# EAGLE design mainboard (EAGLE 7.4.0)
NESIZER synthesizer board
CREVISION: 2
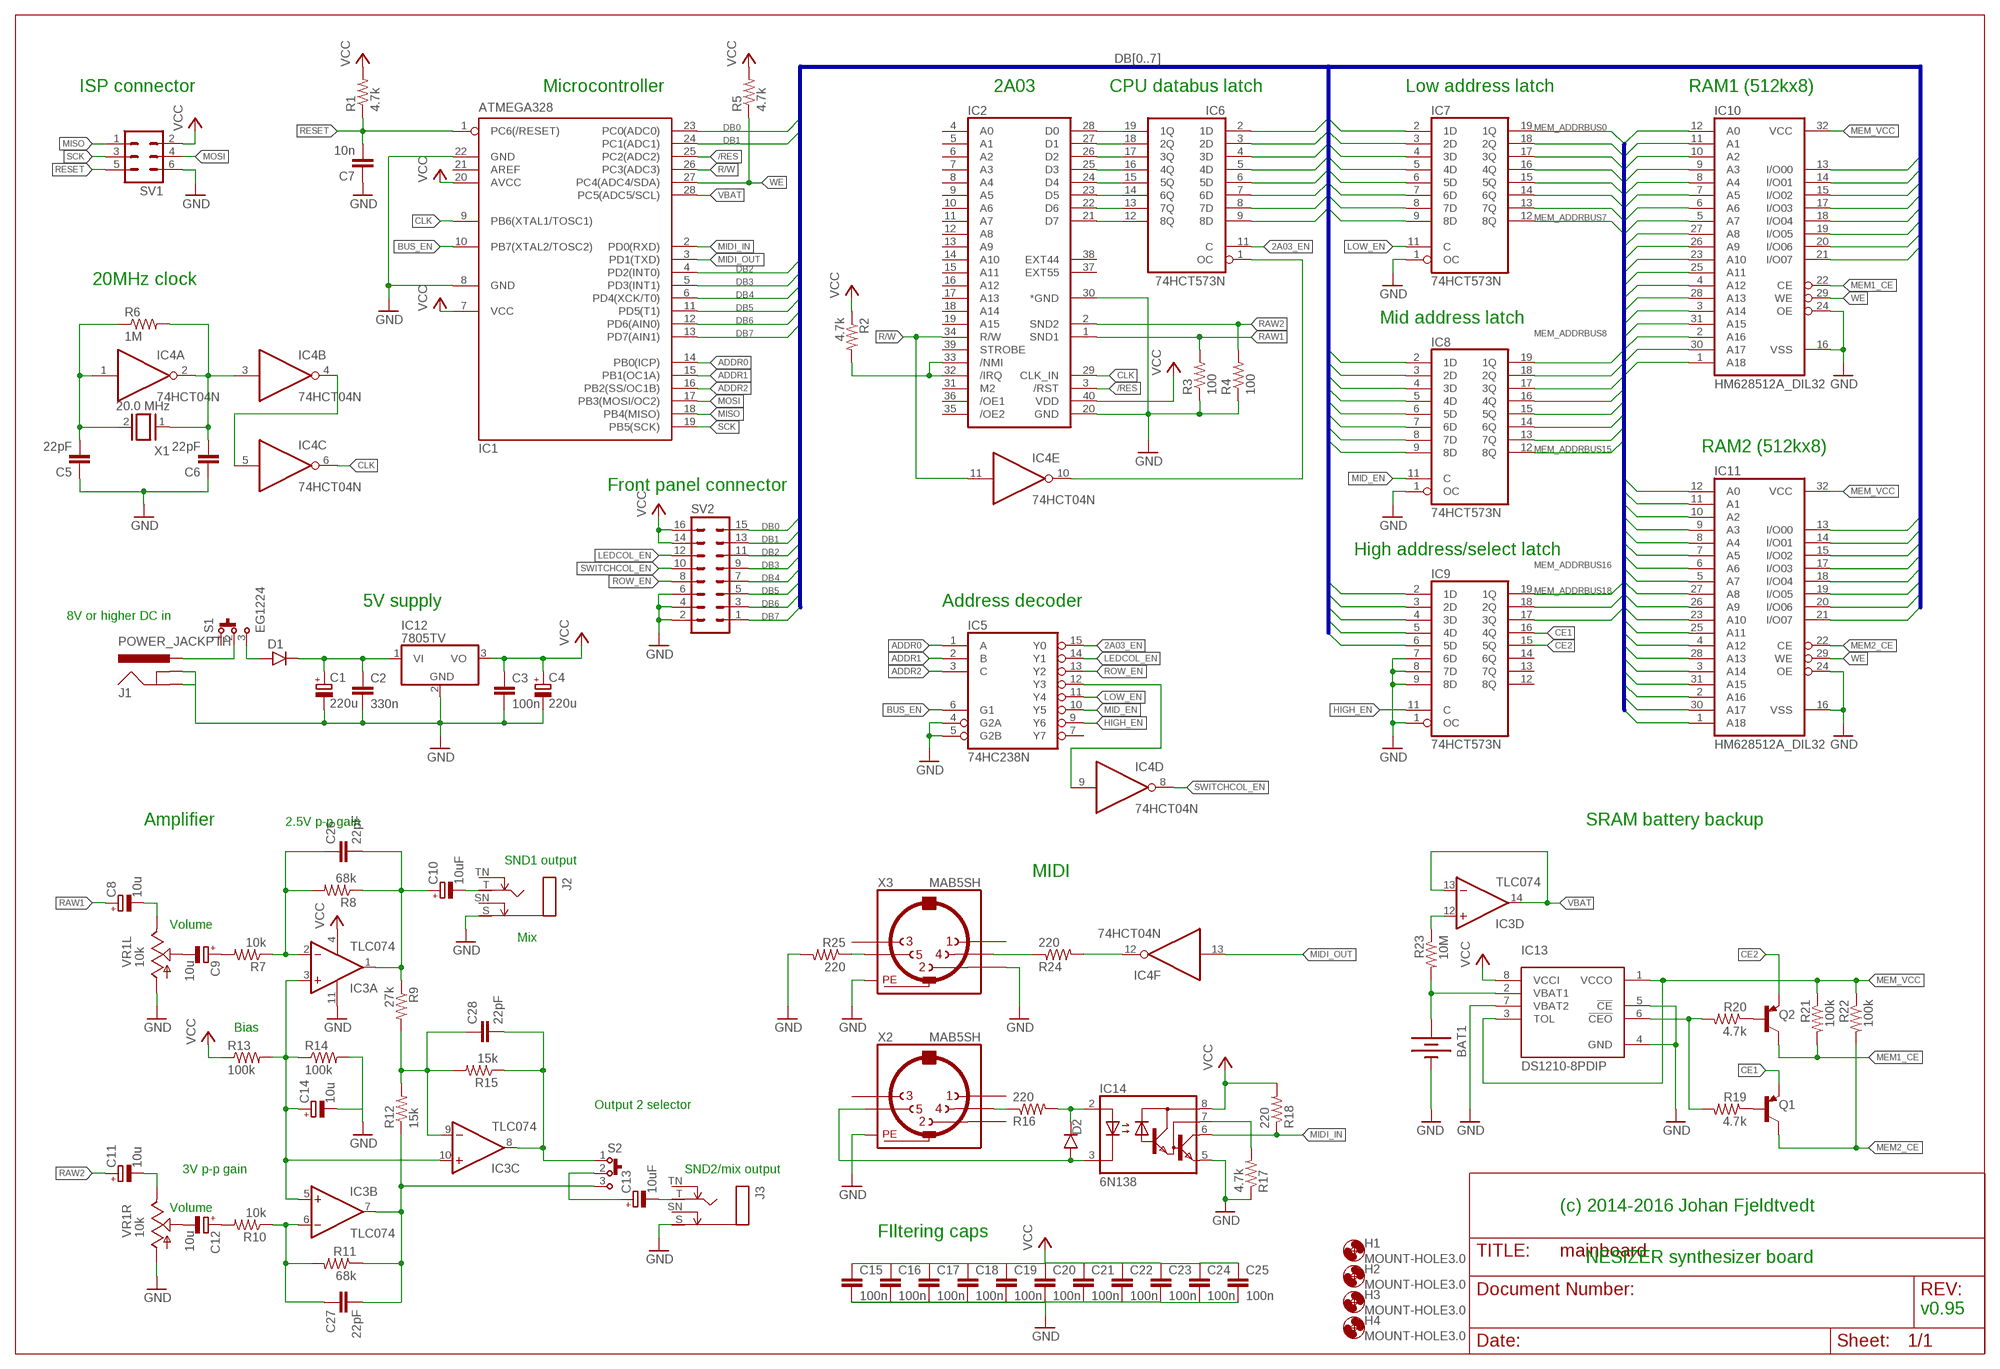
[diagram p0: schematic, sheet 1]

## Parts
BAT1  BATTERY20PTH  [BATTCOM_20MM_PTH]
C1  220u  CPOL-EUE5-10.5  [E5-10,5]
C2  330n  C-EU025-025X050  [C025-025X050]
C3  100n  C-EU025-025X050  [C025-025X050]
C4  220u  CPOL-EUE5-10.5  [E5-10,5]
C5  22pF  C2.5/2  [C2.5-2]
C6  22pF  C2.5/2  [C2.5-2]
C7  10n  C2.5/2  [C2.5-2]
C8  10u  CPOL-EUE2-5  [E2-5]
C9  10u  CPOL-EUE2-5  [E2-5]
C10  10uF  CPOL-EUE2-5  [E2-5]
C11  10u  CPOL-EUE2-5  [E2-5]
C12  10u  CPOL-EUE2-5  [E2-5]
C13  10uF  CPOL-EUE2-5  [E2-5]
C14  10u  CPOL-EUE2-5  [E2-5]
C15  100n  C-EU025-025X050  [C025-025X050]
C16  100n  C-EU025-025X050  [C025-025X050]
C17  100n  C-EU025-025X050  [C025-025X050]
C18  100n  C-EU025-025X050  [C025-025X050]
C19  100n  C-EU025-025X050  [C025-025X050]
C20  100n  C-EU025-025X050  [C025-025X050]
C21  100n  C-EU025-025X050  [C025-025X050]
C22  100n  C-EU025-025X050  [C025-025X050]
C23  100n  C-EU025-025X050  [C025-025X050]
C24  100n  C-EU025-025X050  [C025-025X050]
C25  100n  C-EU025-025X050  [C025-025X050]
C26  22pF  C2.5/2  [C2.5-2]
C27  22pF  C2.5/2  [C2.5-2]
C28  22pF  C2.5/2  [C2.5-2]
D1  1N400X.3  [DO41-3]
D2  1N914.3  [DO35-3]
H1  MOUNT-HOLE3.0  [3,0]
H2  MOUNT-HOLE3.0  [3,0]
H3  MOUNT-HOLE3.0  [3,0]
H4  MOUNT-HOLE3.0  [3,0]
IC1  ATMEGA328  MEGA8-P  [DIL28-3]
IC2  2A03  [DIL40]
IC3  TLC074  TL074P  [DIL14]
IC4  74HCT04N  [DIL14]
IC5  74HC238N  74HC138N  [DIL16]
IC6  74HCT573N  [DIL20]
IC7  74HCT573N  [DIL20]
IC8  74HCT573N  [DIL20]
IC9  74HCT573N  [DIL20]
IC10  HM628512A_DIL32  [DIL32]
IC11  HM628512A_DIL32  [DIL32]
IC12  7805TV  [TO220V]
IC13  DS1210-8PDIP  [DIL08]
IC14  6N138  [DIL08]
J1  POWER_JACKPTH  [POWER_JACK_PTH]
J2  MONOSW  [NMJ4HCD2]
J3  MONOSW  [NMJ4HCD2]
Q1  BC557  [TO92]
Q2  BC557  [TO92]
R1  4.7k  R-US_0207/7  [0207/7]
R2  4.7k  R-US_0207/7  [0207/7]
R3  100  R-US_0207/7  [0207/7]
R4  100  R-US_0207/7  [0207/7]
R5  4.7k  R-US_0207/7  [0207/7]
R6  1M  R-US_0207/7  [0207/7]
R7  10k  R-US_0207/7  [0207/7]
R8  68k  R-US_0207/7  [0207/7]
R9  27k  R-US_0207/7  [0207/7]
R10  10k  R-US_0207/7  [0207/7]
R11  68k  R-US_0207/7  [0207/7]
R12  15k  R-US_0207/7  [0207/7]
R13  100k  R-US_0207/7  [0207/7]
R14  100k  R-US_0207/7  [0207/7]
R15  15k  R-US_0207/7  [0207/7]
R16  220  R-US_0207/7  [0207/7]
R17  4.7k  R-US_0207/7  [0207/7]
R18  220  R-US_0207/7  [0207/7]
R19  4.7k  R-US_0207/7  [0207/7]
R20  4.7k  R-US_0207/7  [0207/7]
R21  100k  R-US_0207/7  [0207/7]
R22  100k  R-US_0207/7  [0207/7]
R23  10M  R-US_0207/7  [0207/7]
R24  220  R-US_0207/7  [0207/7]
R25  220  R-US_0207/7  [0207/7]
S1  EG1224  [EG1224]
S2  EG1224  [EG1224]
SV1  MA03-2  [MA03-2]
SV2  MA08-2  [MA08-2]
VR1  10k  ALPS_RK0971221Z0N  [ALPS_RK0971221Z0X]
X1  20.0 MHz  XTAL/S  [QS]
X2  MAB5SH  [MAB5SH]
X3  MAB5SH  [MAB5SH]

## Nets
2A03_EN: IC5.15(Y0) IC6.11(C)
/RES: IC1.25(PC2(ADC2)) IC2.3(/RST)
ADDR0: IC1.14(PB0(ICP)) IC5.1(A)
ADDR1: IC1.15(PB1(OC1A)) IC5.2(B)
ADDR2: IC1.16(PB2(SS/OC1B)) IC5.3(C)
BUS_EN: IC1.10(PB7(XTAL2/TOSC2)) IC5.6(G1)
C6: C8.- VR1.I1
CE1: IC9.16(4Q) Q1.1(E)
CE2: IC9.15(5Q) Q2.1(E)
CLK: IC1.9(PB6(XTAL1/TOSC1)) IC2.29(CLK_IN) IC4.6(C:O)
DB0: IC1.23(PC0(ADC0)) IC6.2(1D) IC7.2(1D) IC8.2(1D) IC9.2(1D) IC10.13(I/O00) IC11.13(I/O00) SV2.15
DB1: IC1.24(PC1(ADC1)) IC6.3(2D) IC7.3(2D) IC8.3(2D) IC9.3(2D) IC10.14(I/O01) IC11.14(I/O01) SV2.13
DB2: IC1.4(PD2(INT0)) IC6.4(3D) IC7.4(3D) IC8.4(3D) IC9.4(3D) IC10.15(I/O02) IC11.15(I/O02) SV2.11
DB3: IC1.5(PD3(INT1)) IC6.5(4D) IC7.5(4D) IC8.5(4D) IC9.5(4D) IC10.17(I/O03) IC11.17(I/O03) SV2.9
DB4: IC1.6(PD4(XCK/T0)) IC6.6(5D) IC7.6(5D) IC8.6(5D) IC9.6(5D) IC10.18(I/O04) IC11.18(I/O04) SV2.7
DB5: IC1.11(PD5(T1)) IC6.7(6D) IC7.7(6D) IC8.7(6D) IC10.19(I/O05) IC11.19(I/O05) SV2.5
DB6: IC1.12(PD6(AIN0)) IC6.8(7D) IC7.8(7D) IC8.8(7D) IC10.20(I/O06) IC11.20(I/O06) SV2.3
DB7: IC1.13(PD7(AIN1)) IC6.9(8D) IC7.9(8D) IC8.9(8D) IC10.21(I/O07) IC11.21(I/O07) SV2.1
GND: BAT1.2(-) C1.- C2.2 C3.2 C4.- C5.1 C6.1 C7.1 C14.- C15.2 C16.2 C17.2 C18.2 C19.2 C20.2 C21.2 C22.2 C23.2 C24.2 C25.2 IC1.8(GND) IC1.22(GND) IC2.20(GND) IC2.30(*GND) IC3.11(P:V-) IC5.4(G2A) IC5.5(G2B) IC7.1(OC) IC8.1(OC) IC9.1(OC) IC9.7(6D) IC9.8(7D) IC9.9(8D) IC10.16(VSS) IC10.24(OE) IC11.16(VSS) IC11.24(OE) IC12.2(GND) IC13.4(GND) IC13.5(!CE) IC13.7(VBAT2) IC14.5(GND) J1.GND J1.GNDBREAK J2.S J3.S R3.1 R4.1 R14.2 R17.1 R25.2 SV1.6 SV2.2 SV2.4 SV2.6 VR1.G1 VR1.G2 X2.PE X2.PE@(PE) X3.2 X3.PE X3.PE@(PE)
HIGH_EN: IC5.9(Y6) IC9.11(C)
LEDCOL_EN: IC5.14(Y1) SV2.12
LOW_EN: IC5.11(Y4) IC7.11(C)
MEM1_CE: IC10.22(CE) Q2.3(C) R21.2
MEM2_CE: IC11.22(CE) Q1.3(C) R22.2
MEM_ADDRBUS0: IC7.19(1Q) IC10.12(A0) IC11.12(A0)
MEM_ADDRBUS1: IC7.18(2Q) IC10.11(A1) IC11.11(A1)
MEM_ADDRBUS2: IC7.17(3Q) IC10.10(A2) IC11.10(A2)
MEM_ADDRBUS3: IC7.16(4Q) IC10.9(A3) IC11.9(A3)
MEM_ADDRBUS4: IC7.15(5Q) IC10.8(A4) IC11.8(A4)
MEM_ADDRBUS5: IC7.14(6Q) IC10.7(A5) IC11.7(A5)
MEM_ADDRBUS6: IC7.13(7Q) IC10.6(A6) IC11.6(A6)
MEM_ADDRBUS7: IC7.12(8Q) IC10.5(A7) IC11.5(A7)
MEM_ADDRBUS8: IC8.19(1Q) IC10.27(A8) IC11.27(A8)
MEM_ADDRBUS9: IC8.18(2Q) IC10.26(A9) IC11.26(A9)
MEM_ADDRBUS10: IC8.17(3Q) IC10.23(A10) IC11.23(A10)
MEM_ADDRBUS11: IC8.16(4Q) IC10.25(A11) IC11.25(A11)
MEM_ADDRBUS12: IC8.15(5Q) IC10.4(A12) IC11.4(A12)
MEM_ADDRBUS13: IC8.14(6Q) IC10.28(A13) IC11.28(A13)
MEM_ADDRBUS14: IC8.13(7Q) IC10.3(A14) IC11.3(A14)
MEM_ADDRBUS15: IC8.12(8Q) IC10.31(A15) IC11.31(A15)
MEM_ADDRBUS16: IC9.19(1Q) IC10.2(A16) IC11.2(A16)
MEM_ADDRBUS17: IC9.18(2Q) IC10.30(A17) IC11.30(A17)
MEM_ADDRBUS18: IC9.17(3Q) IC10.1(A18) IC11.1(A18)
MEM_VCC: IC10.32(VCC) IC11.32(VCC) IC13.1(VCCO) IC13.3(TOL) R21.1 R22.1
MID_EN: IC5.10(Y5) IC8.11(C)
MIDI_IN: IC1.2(PD0(RXD)) IC14.6(VO) R18.1
MIDI_OUT: IC1.3(PD1(TXD)) IC4.13(F:I)
MIDI_PIN_4: R16.1 X2.4
MIDI_PIN_5: D2.A IC14.3(C) X2.5
MISO: IC1.18(PB4(MISO)) SV1.1
MOSI: IC1.17(PB3(MOSI/OC2)) SV1.4
N$1: C5.2 IC4.1(A:I) R6.1 X1.2
N$2: C6.2 IC4.2(A:O) IC4.3(B:I) R6.2 X1.1
N$3: IC2.21(D7) IC6.12(8Q)
N$4: IC2.22(D6) IC6.13(7Q)
N$5: IC2.23(D5) IC6.14(6Q)
N$6: IC2.24(D4) IC6.15(5Q)
N$7: IC2.25(D3) IC6.16(4Q)
N$8: IC2.26(D2) IC6.17(3Q)
N$9: IC2.27(D1) IC6.18(2Q)
N$10: IC2.28(D0) IC6.19(1Q)
N$11: IC4.4(B:O) IC4.5(C:I)
N$12: IC4.9(D:I) IC5.12(Y3)
N$13: C13.+ S2.2
N$14: C28.1 IC3.9(C:-IN) R9.2 R12.2 R15.2
N$15: C9.+ R7.2
N$16: IC2.32(/IRQ) IC2.33(/NMI) R2.2
N$17: C11.- VR1.I2
N$18: C26.1 IC3.2(A:-IN) R7.1 R8.2
N$19: IC3.12(D:+IN) R23.1
N$20: IC14.7(VB) R17.2
N$21: C12.+ R10.2
N$22: C10.- J2.T
N$23: C13.- J3.T
N$24: C27.1 IC3.6(B:-IN) R10.1 R11.2
N$25: C10.+ C26.2 IC3.1(A:OUT) R8.1 R9.1
N$26: C28.2 IC3.8(C:OUT) R15.1 S2.1
N$27: D1.A S1.3
N$28: C14.+ IC3.3(A:+IN) IC3.5(B:+IN) IC3.10(C:+IN) R13.2 R14.1
N$29: IC4.10(E:O) IC6.1(OC)
N$30: C9.- VR1.O1
N$31: J1.PWR S1.2
N$32: C12.- VR1.O2
N$33: IC13.6(!CEO) R19.2 R20.2
N$34: D2.C IC14.2(A) R16.2
N$35: C1.+ C2.1 D1.C IC12.1(VI)
N$36: C27.2 IC3.7(B:OUT) R11.1 R12.1 S2.3
N$37: Q1.2(B) R19.1
N$38: Q2.2(B) R20.1
N$39: BAT1.1(+) IC13.2(VBAT1) R23.2
N$40: IC4.12(F:O) R24.2
N$41: R24.1 X3.4
N$42: R25.1 X3.5
R/W: IC1.26(PC3(ADC3)) IC2.34(R/W) IC4.11(E:I)
RAW1: C8.+ IC2.1(SND1) R3.2
RAW2: C11.+ IC2.2(SND2) R4.2
RESET: C7.2 IC1.1(PC6(/RESET)) R1.1 SV1.5
ROW_EN: IC5.13(Y2) SV2.8
SCK: IC1.19(PB5(SCK)) SV1.3
SWITCHCOL_EN: IC4.8(D:O) SV2.10
VBAT: IC1.28(PC5(ADC5/SCL)) IC3.13(D:-IN) IC3.14(D:OUT)
VCC: C3.1 C4.+ C15.1 C16.1 C17.1 C18.1 C19.1 C20.1 C21.1 C22.1 C23.1 C24.1 C25.1 IC1.7(VCC) IC1.20(AVCC) IC2.40(VDD) IC3.4(P:V+) IC12.3(VO) IC13.8(VCCI) IC14.8(VCC) R1.2 R2.1 R5.2 R13.1 R18.2 SV1.2 SV2.14 SV2.16
WE: IC1.27(PC4(ADC4/SDA)) IC10.29(WE) IC11.29(WE) R5.1
Unconnected: IC1.21(AREF) IC2.4(A0) IC2.5(A1) IC2.6(A2) IC2.7(A3) IC2.8(A4) IC2.9(A5) IC2.10(A6) IC2.11(A7) IC2.12(A8) IC2.13(A9) IC2.14(A10) IC2.15(A11) IC2.16(A12) IC2.17(A13) IC2.18(A14) IC2.19(A15) IC2.31(M2) IC2.35(/OE2) IC2.36(/OE1) IC2.37(EXT55) IC2.38(EXT44) IC2.39(STROBE) IC5.7(Y7) IC9.12(8Q) IC9.13(7Q) IC9.14(6Q) J2.SN J2.TN J3.SN J3.TN S1.1 X2.1 X2.2 X2.3 X3.1 X3.3

## Buses
DB[0..7]
MEM_ADDRBUS[0..18]

## Notes on the sheet
- ISP connector | Microcontroller | 2A03 | CPU databus latch | Low address latch | RAM1 (512kx8)
- 20MHz clock
- Mid address latch
- RAM2 (512kx8)
- Front panel connector
- High address/select latch
- 5V supply | Address decoder
- 8V or higher DC in
- Amplifier | 2.5V p-p gain | SRAM battery backup
- SND1 output
- MIDI
- Volume
- Mix
- Bias
- Output 2 selector
- 3V p-p gain | SND2/mix output
- Volume | (c) 2014-2016 Johan Fjeldtvedt
- FIltering caps
- NESIZER synthesizer board
- v0.95

## Power pins joined to a net without a drawn wire
GND: IC4.7(P:GND) IC5.8(GND) IC6.10(GND) IC7.10(GND) IC8.10(GND) IC9.10(GND)
S1: VR1.S1
S2: VR1.S2
VCC: IC4.14(P:VCC) IC5.16(VCC) IC6.20(VCC) IC7.20(VCC) IC8.20(VCC) IC9.20(VCC)

## Library data of the parts
BAT1 = SparkFun-Electromechanical:BATTERY: Battery Holders Various common sizes : AA, AAA, 20mm coin cell and 12mm coin cell. 20MM_4LEGS, BATT-10373
C1 C4 C8-C14 = resistor:CPOL-EU: POLARIZED CAPACITOR, European symbol
C2 = resistor:C-EU: CAPACITOR, European symbol
C3 C15-C25 = rcl:C-EU: CAPACITOR, European symbol
C5-C7 C26-C28 = capacitor-wima:C: CAPACITOR naming: grid - package width
D1 = gm-diodes:1N400X: Rectifier Diodes often used in power supply to prevent damage from reverse polarization
D2 = gm-diodes:1N914: Fast Switching Diode DO-35 glass case a.k.a. 1N4148
H1-H4 = holes:MOUNT-HOLE: MOUNTING HOLE with drill center marker
IC1 = atmel:MEGA8-P: MICROCONTROLLER 8 Kbytes FLASH, 1 kbytes SRAM, 512 bytes EEPROM, USART, 4-channel 10 bit ADC, 2-channel 8 bit ADC Pin compatible with Atmega48, ATMega88, ATMega168 Source: avr.lbr; OC_FARNELL: unknown; OC_NEWARK: unknown
IC2 = nes:2A03: MICROCONTROLLER
IC3 = linear:TL074: OP AMP
IC4 = 74xx-eu:74*04: Hex INVERTER
IC5 = 74xx-eu:74*138: 3-line to 8-line DECODER/DEMULTIPLEXER
IC6-IC9 = 74xx-eu:74*573: 8-bit D latch BUS DRIVER
IC10 IC11 = hitachi_sram_hm628512a-series_rev1:HM628512A_DIL32: 4M SRAM 512kword x 8bit
IC12 = linear:78*: Positive VOLTAGE REGULATOR Source: http://cache.national.com/ds/LM/LM78L05.pdf http://www.fairchildsemi.com/ds/LM/LM7805.pdf
IC13 = maxim-custom:DS1210-8PDIP: The DS1210 Nonvolatile Controller Chip is a CMOS circuit which solves the application problem of converting CMOS RAM into nonvolatile memory. Incoming power is monitored for an out-of-tolerance condition. When such a condition is detected, chip enable is inhibited to accomplish write protection and the battery is switched on to supply the RAM with uninterrupted power.
IC14 = optocoupler:6N138: MOTOROLA OPTO COUPLER; MF: VISHAY/TELEFUNKEN; MPN: 6N138; OC_FARNELL: 9860150; OC_NEWARK: 35K5294
J1 = SparkFun-Connectors:POWER_JACK: Power Jack This is the standard 5.5mm barrel jack for power. The PTH is the most common, proven, reliable, footprint. The Slot footprint only works if the mill layer is transmitted to the PCB fab house so be warned. Mating wall wart : TOL-00298 (and others); PROD_ID: PRT-00119
J2 J3 = gm-jacks:MONOSW
Q1 Q2 = transistor-pnp:BC557: PNP Transistor
R1-R25 = rcl:R-US_: RESISTOR, American symbol
S1 S2 = switch-e-switch:EG1224: SLIDE SWITCH
SV1 = con-lstb:MA03-2: PIN HEADER; OC_FARNELL: unknown; OC_NEWARK: unknown
SV2 = con-lstb:MA08-2: PIN HEADER; OC_FARNELL: unknown; OC_NEWARK: unknown
VR1 = audio-pots:ALPS_RK0971221Z0*: ALPS RK0971221Z Dual-gang 9mm potentiometer for volume control, with SPST switch -05 model: 10K with "volume" taper -0N model: 50K with traditional audio taper
X1 = special:XTAL/S: CRYSTAL
X2 X3 = con-hirschmann:MAB5SH: Female CONNECTOR 5 pins 90 deg. with shield, horizontal (DIN 41524); OC_FARNELL: 809883; OC_NEWARK: unknown

## Board
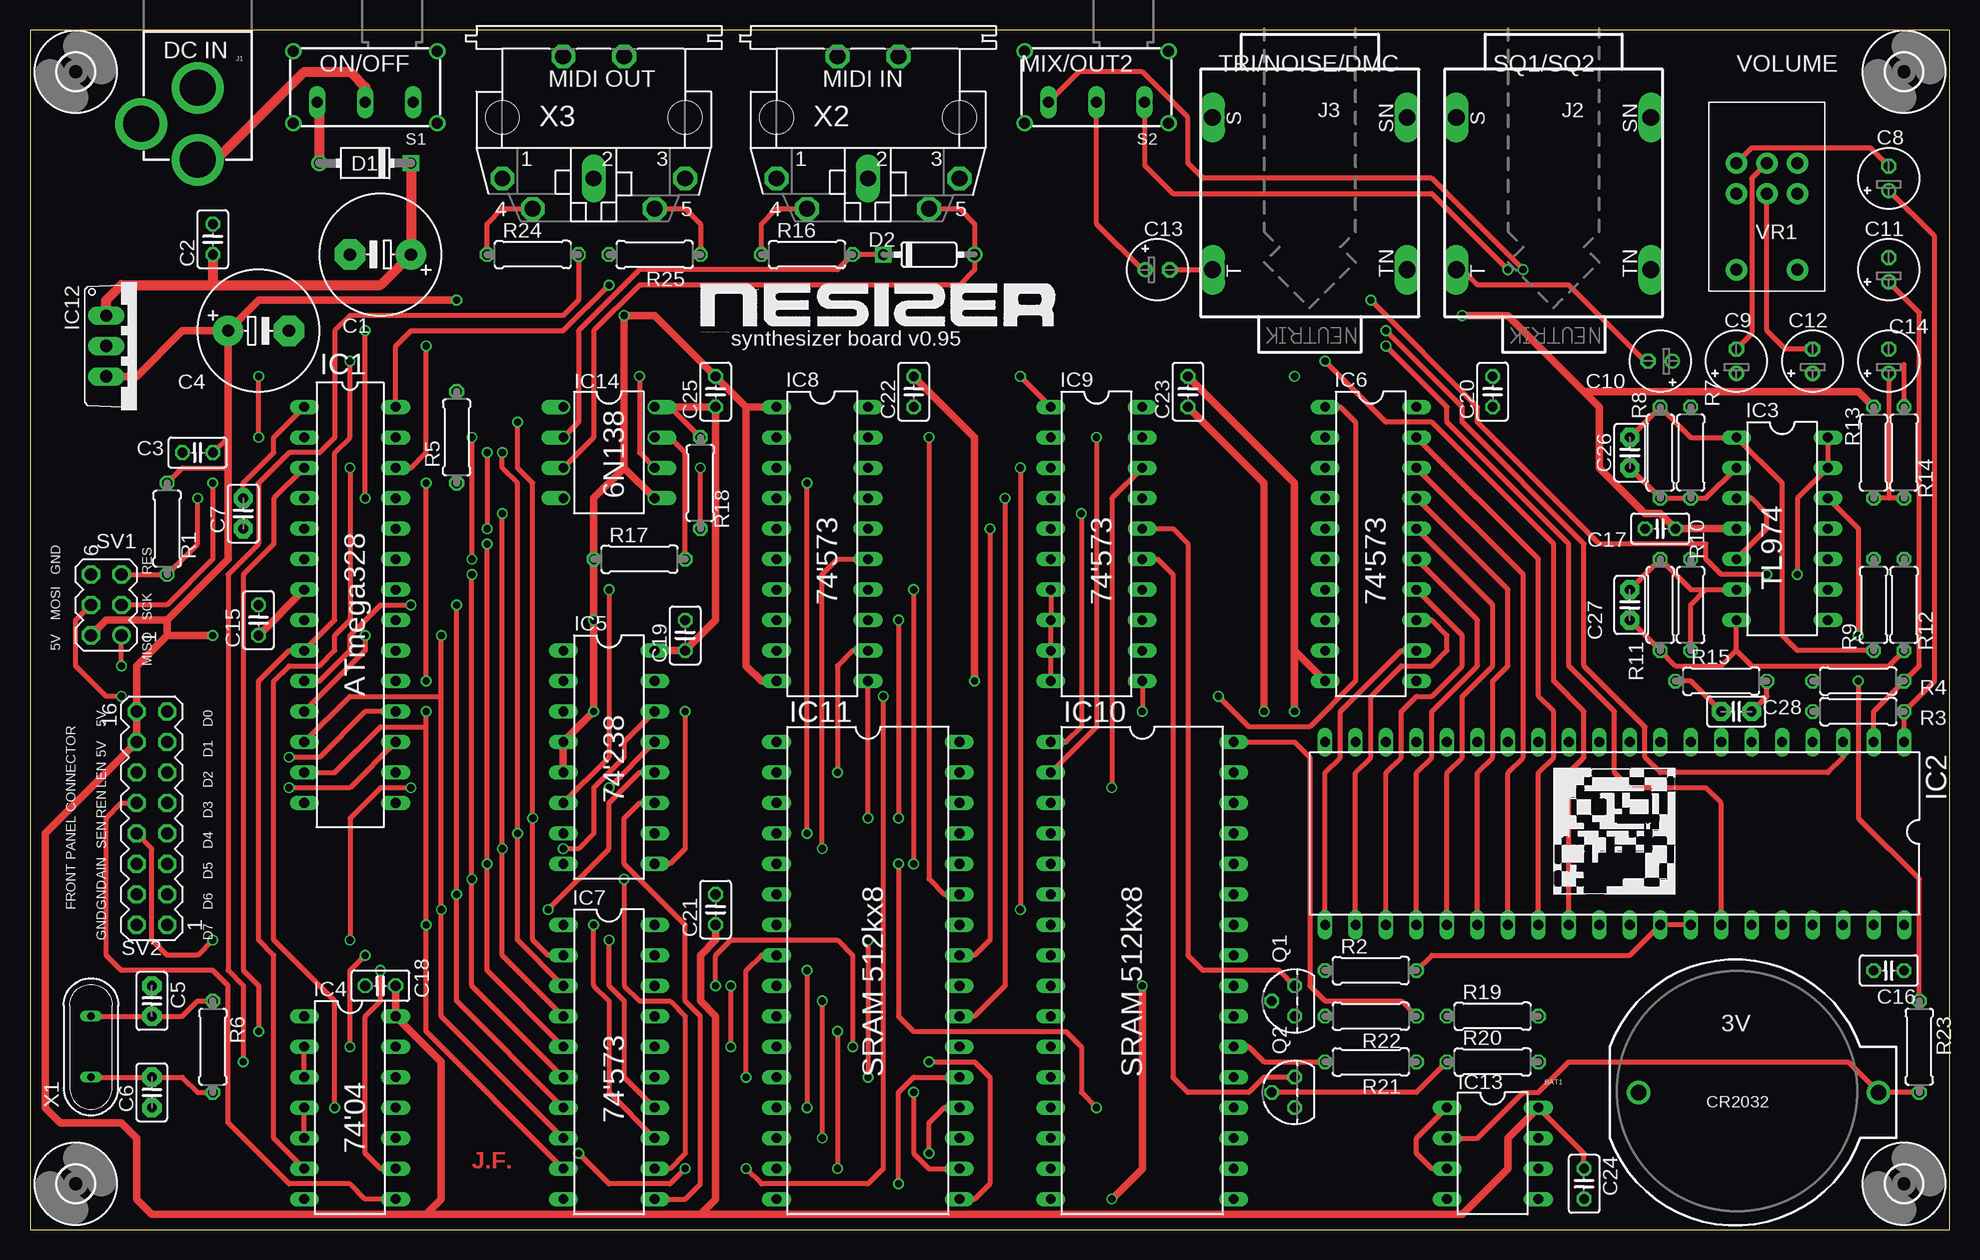
[diagram p1: board, top side]
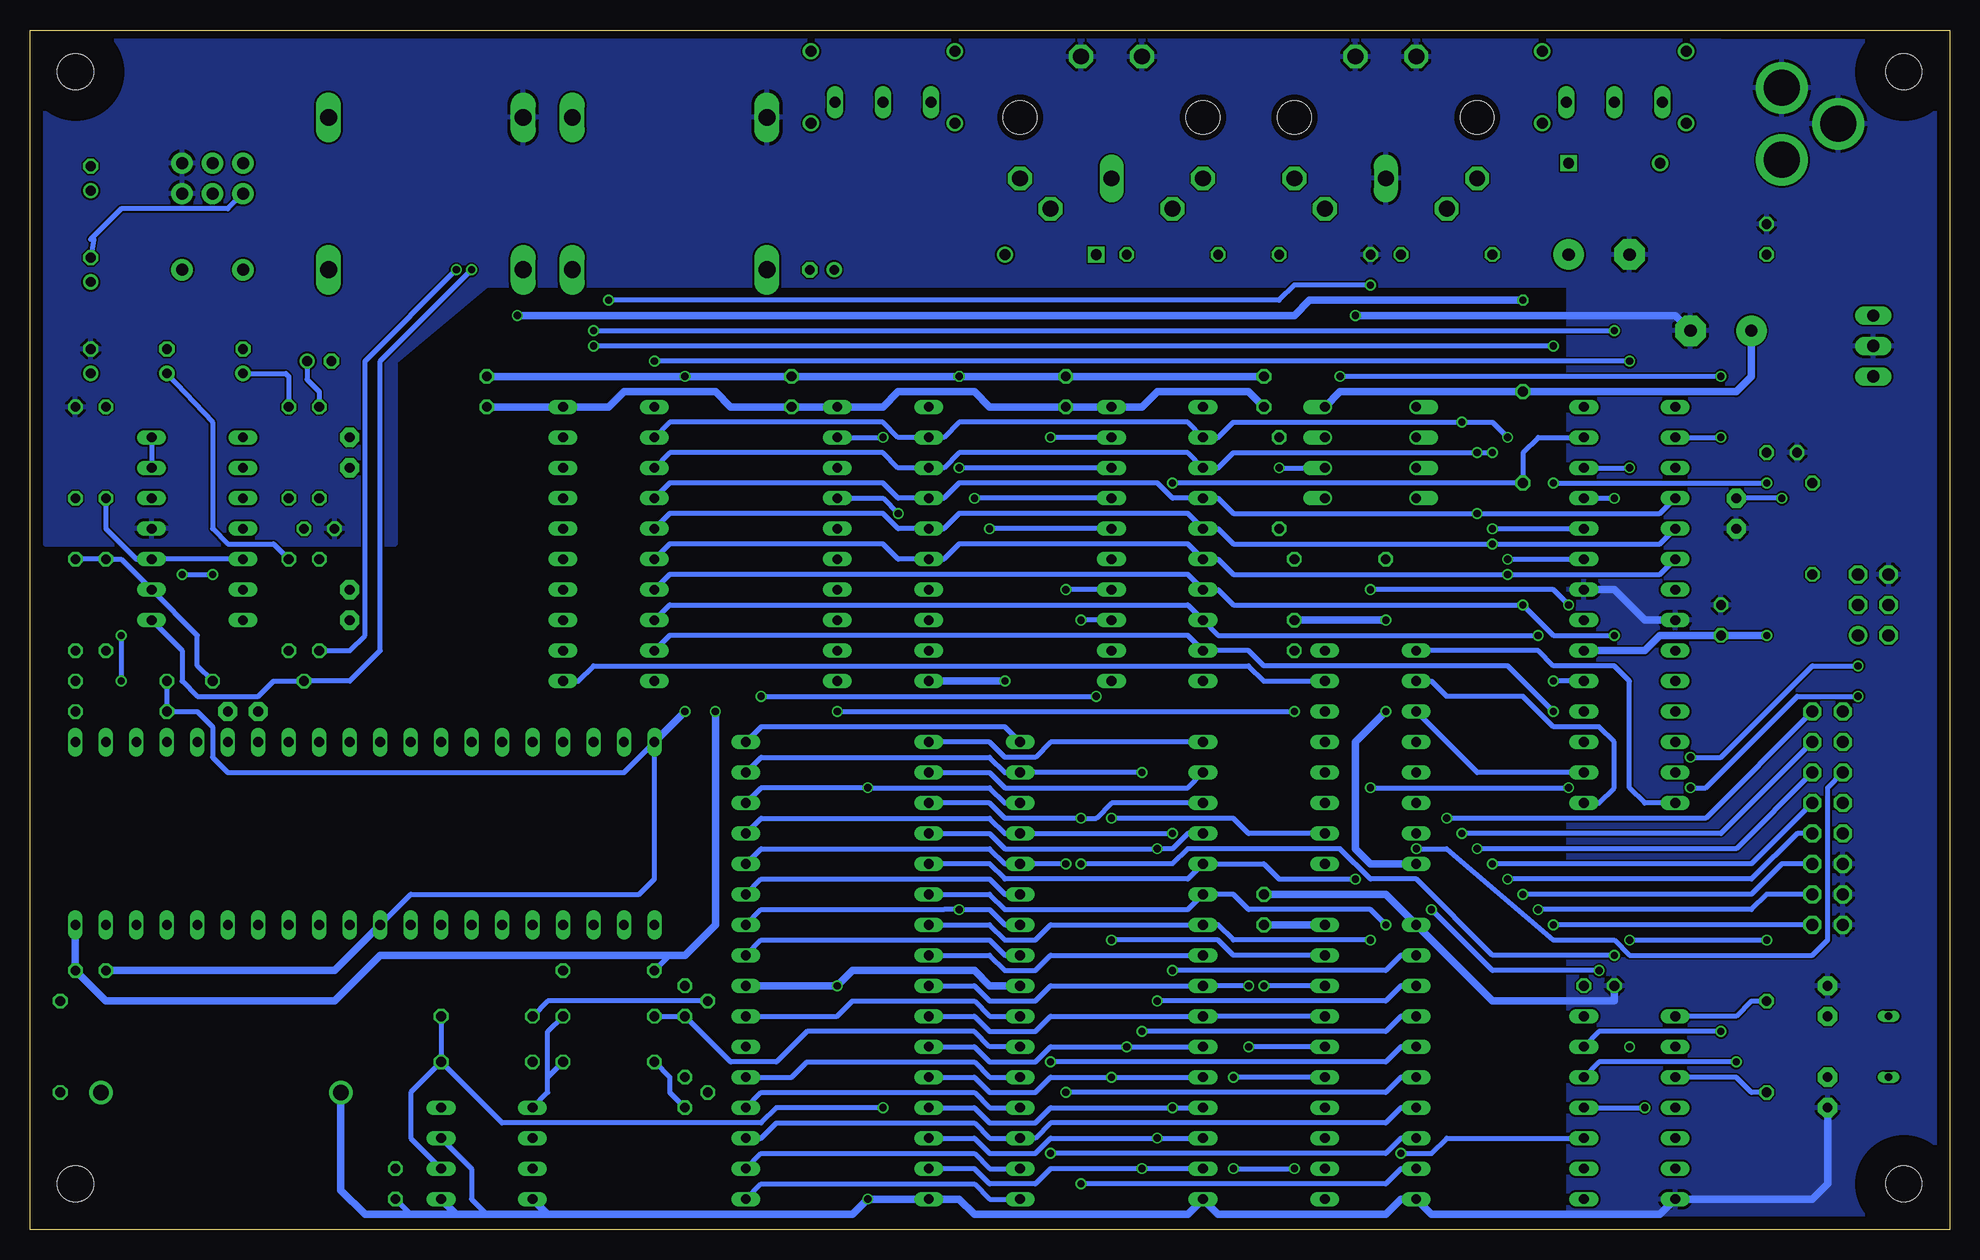
[diagram p2: board, bottom side, seen from below]

Size 160 x 100 mm. Coordinates in mm from the lower left corner, seen from the top.
Outline: 0,0 160,0 160,100 0,100 0,0
Copper layers (1*16): Top 0.035mm / dielectric 1.6mm / Bottom 0.035mm
Design rules "Elecrow_2-layer_PCB_eagle_rule": minimum track width 6mil, minimum drill 12mil, track to track 6mil, track to pad 6mil, pad to pad 6mil, via to via 8mil, smd to smd 0mil, copper to edge 20mil, drill to drill 10mil, minimum pad ring 6mil, minimum via ring 6mil, stop-mask expansion 0mil, vias tented up to drill 100mil, thermal gap 10mil

### Footprints (pad centres in the part's own frame; a part is rotated, then mirrored left to right if it is on the bottom)
BATTCOM_20MM_PTH = drill 1.3: 1 11.85,0; 2 -8.15,0
E5-10,5 = drill 1.016 pad 2.54: + -2.54,0 | drill 1.016 pad 2.54 octagon: - 2.54,0
C025-025X050 = drill 0.813 octagon: 1 -1.27,0; 2 1.27,0
C2.5-2 = drill 0.813 pad 1.6 octagon: 1 -1.27,0; 2 1.27,0
E2-5 = drill 0.813 pad 1.27: + -1.016,0 | drill 0.813 pad 1.27 octagon: - 1.016,0
DO41-3 = drill 0.9: A 3.81,0 | drill 0.9 square: C -3.81,0
DO35-3 = drill 0.9: A 3.81,0 | drill 0.9 square: C -3.81,0
3,0 = hole 3: 0,0
DIL28-3 = drill 0.813 long: 1 -16.51,-3.81; 2 -13.97,-3.81; 3 -11.43,-3.81; 4 -8.89,-3.81; 5 -6.35,-3.81; 6 -3.81,-3.81; 7 -1.27,-3.81; 8 1.27,-3.81; 9 3.81,-3.81; 10 6.35,-3.81; 11 8.89,-3.81; 12 11.43,-3.81; 13 13.97,-3.81; 14 16.51,-3.81; 15 16.51,3.81; 16 13.97,3.81; 17 11.43,3.81; 18 8.89,3.81; 19 6.35,3.81; 20 3.81,3.81; 21 1.27,3.81; 22 -1.27,3.81; 23 -3.81,3.81; 24 -6.35,3.81; 25 -8.89,3.81; 26 -11.43,3.81; 27 -13.97,3.81; 28 -16.51,3.81
DIL40 = drill 0.813 long: 1 -24.13,-7.62; 2 -21.59,-7.62; 3 -19.05,-7.62; 4 -16.51,-7.62; 5 -13.97,-7.62; 6 -11.43,-7.62; 7 -8.89,-7.62; 8 -6.35,-7.62; 9 -3.81,-7.62; 10 -1.27,-7.62; 11 1.27,-7.62; 12 3.81,-7.62; 13 6.35,-7.62; 14 8.89,-7.62; 15 11.43,-7.62; 16 13.97,-7.62; 17 16.51,-7.62; 18 19.05,-7.62; 19 21.59,-7.62; 20 24.13,-7.62; 21 24.13,7.62; 22 21.59,7.62; 23 19.05,7.62; 24 16.51,7.62; 25 13.97,7.62; 26 11.43,7.62; 27 8.89,7.62; 28 6.35,7.62; 29 3.81,7.62; 30 1.27,7.62; 31 -1.27,7.62; 32 -3.81,7.62; 33 -6.35,7.62; 34 -8.89,7.62; 35 -11.43,7.62; 36 -13.97,7.62; 37 -16.51,7.62; 38 -19.05,7.62; 39 -21.59,7.62; 40 -24.13,7.62
DIL14 = drill 0.813 long: 1 -7.62,-3.81; 2 -5.08,-3.81; 3 -2.54,-3.81; 4 0,-3.81; 5 2.54,-3.81; 6 5.08,-3.81; 7 7.62,-3.81; 8 7.62,3.81; 9 5.08,3.81; 10 2.54,3.81; 11 0,3.81; 12 -2.54,3.81; 13 -5.08,3.81; 14 -7.62,3.81
DIL16 = drill 0.813 long: 1 -8.89,-3.81; 2 -6.35,-3.81; 3 -3.81,-3.81; 4 -1.27,-3.81; 5 1.27,-3.81; 6 3.81,-3.81; 7 6.35,-3.81; 8 8.89,-3.81; 9 8.89,3.81; 10 6.35,3.81; 11 3.81,3.81; 12 1.27,3.81; 13 -1.27,3.81; 14 -3.81,3.81; 15 -6.35,3.81; 16 -8.89,3.81
DIL20 = drill 0.813 long: 1 -11.43,-3.81; 2 -8.89,-3.81; 3 -6.35,-3.81; 4 -3.81,-3.81; 5 -1.27,-3.81; 6 1.27,-3.81; 7 3.81,-3.81; 8 6.35,-3.81; 9 8.89,-3.81; 10 11.43,-3.81; 11 11.43,3.81; 12 8.89,3.81; 13 6.35,3.81; 14 3.81,3.81; 15 1.27,3.81; 16 -1.27,3.81; 17 -3.81,3.81; 18 -6.35,3.81; 19 -8.89,3.81; 20 -11.43,3.81
DIL32 = drill 0.813 long: 1 -17.78,-7.62; 2 -15.24,-7.62; 3 -12.7,-7.62; 4 -10.16,-7.62; 5 -7.62,-7.62; 6 -5.08,-7.62; 7 -2.54,-7.62; 8 0,-7.62; 9 2.54,-7.62; 10 5.08,-7.62; 11 7.62,-7.62; 12 10.16,-7.62; 13 12.7,-7.62; 14 15.24,-7.62; 15 17.78,-7.62; 16 20.32,-7.62; 17 20.32,7.62; 18 17.78,7.62; 19 15.24,7.62; 20 12.7,7.62; 21 10.16,7.62; 22 7.62,7.62; 23 5.08,7.62; 24 2.54,7.62; 25 0,7.62; 26 -2.54,7.62; 27 -5.08,7.62; 28 -7.62,7.62; 29 -10.16,7.62; 30 -12.7,7.62; 31 -15.24,7.62; 32 -17.78,7.62
TO220V = drill 1.016 long: 1 -2.54,-2.54; 2 0,-2.54; 3 2.54,-2.54
DIL08 = drill 0.813 long: 1 -3.81,-3.81; 2 -1.27,-3.81; 3 1.27,-3.81; 4 3.81,-3.81; 5 3.81,3.81; 6 1.27,3.81; 7 -1.27,3.81; 8 -3.81,3.81
DIL08' = drill 0.813 offset: 1 -3.81,-3.81; 2 -1.27,-3.81; 3 1.27,-3.81; 4 3.81,-3.81; 5 3.81,3.81; 6 1.27,3.81; 7 -1.27,3.81; 8 -3.81,3.81
POWER_JACK_PTH = drill 2.997 pad 4.318: GND 0,7.7; GNDBREAK 4.7,10.7; PWR 0,13.7
NMJ4HCD2 = drill 1.4 long: S 6.35,8.115; SN 6.35,-8.115; T -6.35,8.115; TN -6.35,-8.115
TO92 = drill 0.813 octagon: 1 1.27,0; 2 0,1.905; 3 -1.27,0
0207/7 = drill 0.813 octagon: 1 -3.81,0; 2 3.81,0
EG1224 = drill 0.914 long: 1 -4,0; 2 0,0; 3 4,0 | drill 0.914: S1 -6,1.75; S2 -6,-4.25; S3 6,1.75; S4 6,-4.25
MA03-2 = drill 1.016: 1 -2.54,-1.27 | drill 1.016 octagon: 2 -2.54,1.27; 3 0,-1.27; 4 0,1.27; 5 2.54,-1.27; 6 2.54,1.27
MA08-2 = drill 1.016 octagon: 1 -8.89,-1.27; 2 -8.89,1.27; 3 -6.35,-1.27; 4 -6.35,1.27; 5 -3.81,-1.27; 6 -3.81,1.27; 7 -1.27,-1.27; 8 -1.27,1.27; 9 1.27,-1.27; 10 1.27,1.27; 11 3.81,-1.27; 12 3.81,1.27; 13 6.35,-1.27; 14 6.35,1.27; 15 8.89,-1.27; 16 8.89,1.27
ALPS_RK0971221Z0X = drill 1.016 pad 1.778: G1 2.54,-2.54; G2 0,-2.54; I1 2.54,2.54; I2 0,2.54; O1 2.54,0; O2 0,0; S1 -6.35,-2.54; S2 -6.35,2.54
QS = drill 0.61 long: 1 -2.54,0; 2 2.54,0
MAB5SH = drill 1.321 octagon: 1 7.62,5.08; 3 -7.62,5.08; 4 5.08,7.62; 5 -5.08,7.62; PE -2.54,-5.08; PE@ 2.54,-5.08 | drill 1.321 long: 2 0,5.08 | hole 2.794: 7.62,0; -7.62,0

### Placement (x,y rotation side)
BAT1  142.24,11.43 0 top
C1  29.21,81.28 180 top
C2  15.24,82.55 90 top
C3  13.97,64.77 180 top
C4  19.05,74.93 0 top
C5  10.16,19.05 270 top
C6  10.16,11.43 90 top
C7  17.78,59.69 90 top
C8  154.94,87.63 90 top
C9  142.24,72.39 90 top
C10  135.89,72.39 180 top
C11  154.94,80.01 90 top
C12  148.59,72.39 90 top
C13  93.98,80.01 0 top
C14  154.94,72.39 90 top
C15  19.05,50.8 90 top
C16  154.94,21.59 180 top
C17  135.89,58.42 180 top
C18  29.21,20.32 180 top
C19  54.61,49.53 90 top
C20  121.92,69.85 90 top
C21  57.15,26.67 90 top
C22  73.66,69.85 90 top
C23  96.52,69.85 90 top
C24  129.54,3.81 270 top
C25  57.15,69.85 90 top
C26  133.35,64.77 90 top
C27  133.35,52.07 270 top
C28  142.24,43.18 180 top
D1  27.94,88.9 180 top
D2  74.93,81.28 0 top
H1  156.21,96.52 0 top
H2  156.21,3.81 0 top
H3  3.81,96.52 0 top
H4  3.81,3.81 0 top
IC1  26.67,52.07 270 top
IC2  132.08,33.02 180 top
IC3  146.05,58.42 270 top
IC4  26.67,10.16 270 top
IC5  48.26,39.37 270 top
IC6  111.76,57.15 270 top
IC7  48.26,13.97 270 top
IC8  66.04,57.15 270 top
IC9  88.9,57.15 270 top
IC10  92.71,22.86 270 top
IC11  69.85,22.86 270 top
IC12  8.89,73.66 270 top
IC13  121.92,6.35 270 top
IC14  6N138  [DIL08']  48.26,64.77 270 top
J1  13.97,102.87 180 top
J2  127,86.36 90 top
J3  106.68,86.36 90 top
Q1  105.41,19.05 90 top
Q2  105.41,11.43 90 top
R1  11.43,58.42 90 top
R2  111.76,21.59 0 top
R3  152.4,43.18 0 top
R4  152.4,45.72 0 top
R5  35.56,66.04 90 top
R6  15.24,15.24 270 top
R7  138.43,64.77 90 top
R8  135.89,64.77 270 top
R9  153.67,52.07 90 top
R10  138.43,52.07 90 top
R11  135.89,52.07 90 top
R12  156.21,52.07 90 top
R13  153.67,64.77 270 top
R14  156.21,64.77 90 top
R15  140.97,45.72 0 top
R16  64.77,81.28 0 top
R17  50.8,55.88 0 top
R18  55.88,62.23 90 top
R19  121.92,17.78 0 top
R20  121.92,13.97 0 top
R21  111.76,13.97 180 top
R22  111.76,17.78 180 top
R23  157.48,15.24 270 top
R24  41.91,81.28 0 top
R25  52.07,81.28 180 top
S1  27.94,93.98 180 top
S2  88.9,93.98 180 top
SV1  6.35,52.07 90 top
SV2  10.16,34.29 90 top
U$1  [NESIZER_LOGO]  55.88,74.93 0 top
U$2  [MARIO]  127,27.94 0 top
VR1  144.78,86.36 90 top
X1  5.08,15.24 90 top
X2  69.85,92.71 180 top
X3  46.99,92.71 180 top

### Tracks (layer width: path | path; a pad name or v marks a point on that pad's centre or on a via)
2A03_EN
  Bottom 0.406: IC6.11 114.3,45.72 113.03,46.99 58.42,46.99 57.15,45.72 IC5.15
/RES  (via drill 0.6)
  Top 0.406: IC2.3 151.13,39.37 149.86,38.1 135.89,38.1 134.62,39.37 134.62,41.91 129.54,46.99 129.54,57.15 119.38,67.31 119.38,68.58 v113.03,74.93 | v27.94,60.96 v27.94,74.93
  Bottom 0.406: IC1.25 v27.94,60.96 | v113.03,74.93 v27.94,74.93
ADDR0
  Bottom 0.406: IC1.14 25.4,35.56 26.67,36.83 26.67,45.72 27.94,46.99 33.02,46.99 34.29,48.26 IC5.1
ADDR1
  Bottom 0.406: IC5.2 43.18,45.72 41.91,44.45 35.56,44.45 33.02,41.91 29.21,41.91 27.94,40.64 27.94,36.83 29.21,35.56 IC1.15
ADDR2
  Bottom 0.406: IC1.16 39.37,38.1 IC5.3
BUS_EN  (via drill 0.6)
  Top 0.406: IC5.6 48.26,39.37 v48.26,53.34 | IC1.10 24.13,45.72 26.67,48.26 26.67,49.53 29.21,52.07 v31.75,52.07
  Bottom 0.406: v31.75,52.07 33.02,53.34 v48.26,53.34
C6
  Top 0.406: VR1.I1 143.51,90.17 153.42,90.17 C8.-
CE1
  Top 0.406: IC9.16 95.25,58.42 96.52,57.15 96.52,22.86 97.79,21.59 102.87,21.59 104.14,21.59 Q1.1
CE2
  Top 0.406: IC9.15 93.98,55.88 95.25,54.61 95.25,12.7 96.52,11.43 101.6,11.43 102.87,12.7 Q2.1
CLK  (via drill 0.6)
  Top 0.406: IC4.6 20.32,7.62 20.32,22.86 19.05,24.13 19.05,45.72 21.59,48.26 IC1.9 25.4,50.8 25.4,64.77 26.67,66.04 v26.67,72.39 | IC2.29 128.27,38.1 129.54,39.37 129.54,43.18 127,45.72 127,57.15 116.84,67.31 113.03,67.31 v107.95,72.39
  Bottom 0.406: v26.67,72.39 v107.95,72.39
DB0  (via drill 0.6)
  Top 0.406: v36.83,66.04 v36.83,55.88 | IC7.2 43.18,22.86 41.91,24.13 v41.91,34.29 41.91,62.23 40.64,63.5 v40.64,67.31 | v64.77,21.59 v64.77,10.16
  Bottom 0.406: IC10.13 81.28,10.16 80.01,8.89 76.2,8.89 74.93,10.16 v64.77,10.16 IC11.13 | IC6.2 106.68,67.31 88.9,67.31 87.63,66.04 IC9.2 83.82,66.04 82.55,67.31 63.5,67.31 IC8.2 60.96,66.04 59.69,67.31 v40.64,67.31 38.1,67.31 v36.83,66.04 | v36.83,55.88 IC1.23 | SV2.15 20.32,34.29 v41.91,34.29 | IC7.2 45.72,22.86 46.99,21.59 v64.77,21.59
DB1  (via drill 0.6)
  Top 0.406: IC7.3 40.64,24.13 v40.64,33.02 40.64,62.23 39.37,63.5 v39.37,64.77 | v38.1,64.77 v38.1,58.42 | v66.04,19.05 v66.04,7.62
  Bottom 0.406: IC10.14 81.28,7.62 80.01,6.35 76.2,6.35 74.93,7.62 v66.04,7.62 IC11.14 | IC6.3 106.68,64.77 88.9,64.77 87.63,63.5 IC9.3 83.82,63.5 82.55,64.77 63.5,64.77 IC8.3 60.96,63.5 59.69,64.77 v39.37,64.77 v38.1,64.77 | v38.1,58.42 IC1.24 | SV2.13 19.05,33.02 v40.64,33.02 | IC7.3 45.72,20.32 46.99,19.05 v66.04,19.05
DB2  (via drill 0.6)
  Top 0.406: IC7.4 39.37,22.86 v39.37,31.75 v39.37,59.69 | v67.31,16.51 v67.31,5.08
  Bottom 0.406: IC11.15 v67.31,5.08 74.93,5.08 76.2,3.81 80.01,3.81 81.28,5.08 IC10.15 | IC6.4 106.68,62.23 88.9,62.23 87.63,60.96 IC9.4 83.82,60.96 82.55,62.23 66.04,62.23 64.77,60.96 IC8.4 60.96,60.96 59.69,59.69 v39.37,59.69 24.13,59.69 IC1.4 | SV2.11 17.78,31.75 v39.37,31.75 | IC7.4 45.72,17.78 46.99,16.51 v67.31,16.51
DB3  (via drill 0.6)
  Top 0.406: IC7.5 38.1,21.59 v38.1,30.48 v38.1,57.15 | v74.93,13.97 78.74,13.97 80.01,12.7 80.01,3.81 78.74,2.54 IC11.17
  Bottom 0.406: IC10.17 99.06,3.81 81.28,3.81 80.01,2.54 IC11.17 | IC6.5 106.68,59.69 88.9,59.69 87.63,58.42 IC9.5 83.82,58.42 82.55,59.69 63.5,59.69 IC8.5 60.96,58.42 59.69,57.15 v38.1,57.15 24.13,57.15 IC1.5 | SV2.9 16.51,30.48 v38.1,30.48 | IC7.5 45.72,15.24 46.99,13.97 v74.93,13.97
DB4  (via drill 0.6)
  Top 0.406: IC7.6 36.83,20.32 v36.83,29.21 v36.83,54.61 | v73.66,11.43 73.66,6.35 74.93,5.08 IC11.18
  Bottom 0.406: IC10.18 99.06,6.35 81.28,6.35 80.01,5.08 IC11.18 | IC6.6 106.68,57.15 88.9,57.15 87.63,55.88 IC9.6 83.82,55.88 82.55,57.15 63.5,57.15 IC8.6 60.96,55.88 59.69,54.61 v36.83,54.61 24.13,54.61 IC1.6 | SV2.7 12.7,33.02 16.51,29.21 v36.83,29.21 | IC7.6 45.72,12.7 46.99,11.43 v73.66,11.43
DB5  (via drill 0.6)
  Top 0.406: v27.94,49.53 27.94,48.26 IC1.11 | IC7.7 35.56,19.05 v35.56,27.94 v35.56,52.07
  Bottom 0.406: IC10.19 99.06,7.62 97.79,8.89 81.28,8.89 80.01,7.62 IC11.19 76.2,7.62 74.93,8.89 46.99,8.89 45.72,10.16 IC7.7 | IC6.7 106.68,54.61 63.5,54.61 IC8.7 60.96,53.34 59.69,52.07 v35.56,52.07 33.02,49.53 v27.94,49.53 | SV2.5 13.97,30.48 16.51,27.94 v35.56,27.94
DB6  (via drill 0.6)
  Top 0.406: IC7.8 34.29,17.78 v34.29,26.67 34.29,44.45 | 34.29,44.45 v34.29,49.53 | IC1.12 26.67,44.45 34.29,44.45 | v74.93,6.35 74.93,8.89 76.2,10.16 IC11.20
  Bottom 0.406: IC10.20 99.06,11.43 81.28,11.43 80.01,10.16 IC11.20 | IC6.8 106.68,52.07 63.5,52.07 IC8.8 60.96,49.53 v34.29,49.53 | SV2.3 15.24,27.94 16.51,26.67 v34.29,26.67 | IC7.8 45.72,7.62 46.99,6.35 v74.93,6.35
DB7  (via drill 0.6)
  Top 0.406: IC7.9 33.02,16.51 v33.02,25.4 33.02,41.91 | 33.02,41.91 v33.02,43.18 | IC1.13 25.4,38.1 29.21,41.91 33.02,41.91 | v72.39,3.81 72.39,11.43 73.66,12.7 IC11.21
  Bottom 0.406: IC10.21 96.52,12.7 95.25,13.97 81.28,13.97 80.01,12.7 IC11.21 | IC6.9 106.68,49.53 63.5,49.53 IC8.9 58.42,48.26 57.15,46.99 36.83,46.99 v33.02,43.18 | SV2.1 v33.02,25.4 | IC7.9 45.72,5.08 46.99,3.81 v72.39,3.81
GND  (via drill 0.6)
  Top 0.406: IC9.1 v82.55,71.12 | R14.2 156.21,72.14 | IC9.10 IC9.9 IC9.8 IC9.7
  Top 0.61: IC5.5 IC5.4 v46.99,43.18 v46.99,50.8 R17.1 46.99,60.96 49.53,63.5 | v92.71,20.32 92.71,5.08 v90.17,2.54 | IC14.5 49.53,63.5 | 49.53,63.5 v49.53,76.2 52.07,76.2 C25.2 59.69,68.58 | 105.41,48.26 105.41,62.23 C23.2 | v105.41,43.18 105.41,48.26 | 105.41,48.26 IC6.10 | C22.2 78.74,66.04 v78.74,45.72 | IC8.10 60.96,45.72 59.69,46.99 59.69,68.58 | 59.69,68.58 IC8.1
  Bottom 0.406: IC2.30 128.27,27.94 109.22,27.94 107.95,29.21 IC2.20 110.49,38.1 143.51,38.1 144.78,39.37 144.78,41.91 146.05,43.18 R3.1 R4.1 | IC13.7 123.19,5.08 123.19,2.54 121.92,1.27 | C24.2 128.27,1.27
  Bottom 0.61: IC1.8 25.4,50.8 27.94,53.34 IC1.22 | C6.1 10.16,3.81 11.43,2.54 IC4.7 24.13,1.27 43.18,1.27 IC7.10 45.72,2.54 46.99,1.27 60.96,1.27 IC11.16 63.5,1.27 81.28,1.27 82.55,2.54 IC10.16 v90.17,2.54 91.44,1.27 116.84,1.27 | 116.84,1.27 121.92,1.27 124.46,1.27 | 124.46,1.27 128.27,1.27 132.08,1.27 134.09,3.28 BAT1.2 | IC11.24 80.01,20.32 81.28,21.59 91.44,21.59 v92.71,20.32 IC10.24 | IC5.8 48.26,30.48 49.53,31.75 49.53,40.64 v46.99,43.18 | C25.2 C22.2 v82.55,71.12 C23.2 v105.41,71.12 C20.2 | v49.53,76.2 22.86,76.2 C4.- | C18.2 27.94,19.05 38.1,19.05 IC7.1 46.99,27.94 C21.2 | C16.2 134.62,21.59 IC2.30 | IC2.20 v105.41,43.18 | v46.99,50.8 C19.2 | IC9.10 v78.74,45.72 | IC13.5 124.46,1.27 | IC13.4 116.84,1.27
  pour Bottom: 158.75,57.15 129.54,57.15 129.54,72.39 121.92,78.74 25.4,78.74 22.86,76.2 20.32,78.74 19.05,99.06 153.67,99.06 158.75,93.98
  pour Bottom: 20.32,78.74 20.32,99.06 6.35,99.06 1.27,93.98 1.27,6.35 6.35,1.27 31.75,1.27 31.75,78.74
HIGH_EN  (via drill 0.6)
  Top 0.406: IC9.11 v92.71,43.18 | v54.61,43.18 54.61,31.75 53.34,30.48 IC5.9
  Bottom 0.406: v92.71,43.18 v54.61,43.18
LEDCOL_EN  (via drill 0.6)
  Top 0.406: IC5.14 49.53,40.64 49.53,39.37 46.99,36.83 46.99,33.02 45.72,31.75 v44.45,31.75
  Bottom 0.406: v44.45,31.75 41.91,31.75 33.02,24.13 27.94,24.13 26.67,22.86 11.43,22.86 10.16,24.13 10.16,36.83 SV2.12
LOW_EN
  Top 0.406: IC7.11 54.61,2.54 55.88,3.81 55.88,17.78 54.61,19.05 54.61,25.4 49.53,30.48 49.53,34.29 50.8,35.56 IC5.11
MEM1_CE
  Top 0.406: IC10.22 101.6,15.24 102.87,13.97 R21.2
  Bottom 0.406: R21.2 106.68,12.7 106.68,11.43 Q2.3
MEM2_CE
  Bottom 0.406: IC11.22 80.01,15.24 81.28,16.51 95.25,16.51 97.79,13.97 101.6,13.97 Q1.3 R22.2
MEM_ADDRBUS0  (via drill 0.6)
  Top 0.406: v69.85,24.13 v69.85,12.7
  Bottom 0.406: IC10.12 81.28,12.7 80.01,11.43 76.2,11.43 74.93,12.7 v69.85,12.7 IC11.12 | IC7.19 59.69,22.86 60.96,24.13 v69.85,24.13
MEM_ADDRBUS1  (via drill 0.6)
  Top 0.406: v68.58,15.24 68.58,22.86 67.31,24.13 58.42,24.13 57.15,22.86 v57.15,20.32
  Bottom 0.406: IC10.11 81.28,15.24 80.01,13.97 76.2,13.97 74.93,15.24 v68.58,15.24 IC11.11 | IC7.18 v57.15,20.32
MEM_ADDRBUS2
  Bottom 0.406: IC10.10 81.28,17.78 80.01,16.51 76.2,16.51 74.93,17.78 IC11.10 IC7.17
MEM_ADDRBUS3  (via drill 0.6)
  Top 0.406: v58.42,20.32 58.42,19.05 v58.42,15.24
  Bottom 0.406: IC10.9 81.28,20.32 80.01,19.05 76.2,19.05 74.93,20.32 IC11.9 v58.42,20.32 | IC7.16 v58.42,15.24
MEM_ADDRBUS4  (via drill 0.6)
  Top 0.406: v59.69,12.7 59.69,21.59 60.96,22.86 IC11.8
  Bottom 0.406: IC10.8 80.01,22.86 78.74,21.59 76.2,21.59 74.93,22.86 IC11.8 | IC7.15 v59.69,12.7
MEM_ADDRBUS5  (via drill 0.6)
  Top 0.406: v48.26,24.13 48.26,20.32 49.53,19.05 49.53,12.7 IC7.14
  Bottom 0.406: IC10.7 80.01,25.4 78.74,24.13 76.2,24.13 74.93,25.4 IC11.7 60.96,25.4 59.69,24.13 v48.26,24.13
MEM_ADDRBUS6  (via drill 0.6)
  Top 0.406: v46.99,25.4 46.99,20.32 48.26,19.05 48.26,11.43 IC7.13
  Bottom 0.406: IC10.6 80.01,27.94 78.74,26.67 63.5,26.67 IC11.6 59.69,27.94 58.42,26.67 48.26,26.67 v46.99,25.4
MEM_ADDRBUS7  (via drill 0.6)
  Top 0.406: v49.53,29.21 49.53,20.32 50.8,19.05 53.34,19.05 54.61,17.78 54.61,6.35 53.34,5.08 IC7.12
  Bottom 0.406: IC10.5 80.01,30.48 78.74,29.21 63.5,29.21 IC11.5 57.15,30.48 55.88,29.21 v49.53,29.21
MEM_ADDRBUS8  (via drill 0.6)
  Top 0.406: v74.93,66.04 74.93,29.21 76.2,27.94 IC11.27
  Bottom 0.406: IC10.27 99.06,29.21 80.01,29.21 78.74,27.94 IC11.27 | IC8.19 v74.93,66.04
MEM_ADDRBUS9  (via drill 0.6)
  Top 0.406: v82.55,63.5 v82.55,26.67
  Bottom 0.406: IC10.26 99.06,26.67 83.82,26.67 v82.55,26.67 80.01,26.67 78.74,25.4 IC11.26 | IC8.18 v82.55,63.5
MEM_ADDRBUS10  (via drill 0.6)
  Top 0.406: v81.28,60.96 81.28,20.32 78.74,17.78 IC11.23
  Bottom 0.406: IC10.23 92.71,17.78 91.44,19.05 81.28,19.05 80.01,17.78 IC11.23 | IC8.17 v81.28,60.96
MEM_ADDRBUS11  (via drill 0.6)
  Top 0.406: v80.01,58.42 80.01,24.13 78.74,22.86 IC11.25
  Bottom 0.406: IC10.25 99.06,24.13 80.01,24.13 78.74,22.86 IC11.25 | IC8.16 v80.01,58.42
MEM_ADDRBUS12  (via drill 0.6)
  Top 0.406: v66.04,31.75 66.04,54.61 67.31,55.88 IC8.15
  Bottom 0.406: IC10.4 80.01,33.02 78.74,31.75 v66.04,31.75 64.77,31.75 63.5,33.02 IC11.4
MEM_ADDRBUS13  (via drill 0.6)
  Top 0.406: v73.66,53.34 v73.66,30.48
  Bottom 0.406: IC10.28 99.06,31.75 80.01,31.75 78.74,30.48 IC11.28 v73.66,30.48 | IC8.14 v73.66,53.34
MEM_ADDRBUS14  (via drill 0.6)
  Top 0.406: v72.39,50.8 v72.39,34.29
  Bottom 0.406: IC11.3 69.85,35.56 71.12,34.29 v72.39,34.29 78.74,34.29 80.01,35.56 IC10.3 | IC8.13 v72.39,50.8
MEM_ADDRBUS15  (via drill 0.6)
  Top 0.406: IC8.12 68.58,48.26 67.31,46.99 v67.31,38.1
  Bottom 0.406: IC10.31 99.06,39.37 80.01,39.37 78.74,38.1 IC11.31 v67.31,38.1
MEM_ADDRBUS16  (via drill 0.6)
  Top 0.406: v88.9,66.04 88.9,41.91 IC10.2
  Bottom 0.406: IC10.2 80.01,38.1 78.74,36.83 63.5,36.83 IC11.2 | IC9.19 v88.9,66.04
MEM_ADDRBUS17  (via drill 0.6)
  Top 0.406: IC9.18 90.17,60.96 v90.17,36.83
  Bottom 0.406: IC11.30 78.74,35.56 80.01,36.83 v90.17,36.83 99.06,36.83 IC10.30
MEM_ADDRBUS18  (via drill 0.6)
  Top 0.406: v87.63,59.69 87.63,41.91 86.36,40.64 IC10.1
  Bottom 0.406: IC11.1 74.93,40.64 76.2,39.37 78.74,39.37 80.01,40.64 IC10.1 | IC9.17 88.9,60.96 v87.63,59.69
MEM_VCC
  Top 0.406: IC10.32 105.41,40.64 106.68,39.37 106.68,20.32 107.95,19.05 114.3,19.05 R22.1 | IC13.3 116.84,5.08 115.57,6.35 115.57,7.62 IC13.1
  Bottom 0.406: IC11.32 78.74,41.91 99.06,41.91 IC10.32 | IC13.1 116.84,11.43 116.84,12.7 | 116.84,12.7 116.84,16.51 R22.1 | R21.1 116.84,12.7
MID_EN  (via drill 0.6)
  Top 0.406: v69.85,34.29 IC8.11
  Bottom 0.406: IC5.10 58.42,33.02 59.69,34.29 v69.85,34.29
MIDI_IN  (via drill 0.6)
  Top 0.406: IC14.6 50.8,64.77 v50.8,71.12 | v19.05,66.04 v19.05,71.12 | R18.1 v55.88,63.5
  Bottom 0.406: IC1.2 v19.05,66.04 | v19.05,71.12 v50.8,71.12 | v55.88,63.5 IC14.6
MIDI_OUT  (via drill 0.6)
  Top 0.406: IC1.3 20.32,60.96 20.32,57.15 17.78,54.61 17.78,21.59 19.05,20.32 v19.05,16.51
  Bottom 0.406: v19.05,16.51 29.21,16.51 IC4.13
MIDI_PIN_4
  Top 0.406: R16.1 60.96,83.82 62.23,85.09 X2.4
MIDI_PIN_5
  Top 0.406: IC14.3 46.99,66.04 46.99,74.93 50.8,78.74 77.47,78.74 78.74,80.01 D2.A 78.74,83.82 77.47,85.09 X2.5
MISO  (via drill 0.6)
  Top 0.406: IC1.18 27.94,43.18 24.13,39.37 v21.59,39.37 | v7.62,46.99 SV1.1
  Bottom 0.406: v21.59,39.37 19.05,39.37 11.43,46.99 v7.62,46.99
MOSI  (via drill 0.6)
  Top 0.406: IC1.17 26.67,36.83 v21.59,36.83 | v7.62,44.45 6.35,44.45 3.81,46.99 3.81,50.8 SV1.4
  Bottom 0.406: v21.59,36.83 20.32,36.83 12.7,44.45 v7.62,44.45
N$1
  Top 0.406: X1.2 C5.2 12.7,17.78 13.97,19.05 R6.1
  Bottom 0.406: IC4.1 17.78,17.78 16.51,19.05 R6.1
N$2
  Top 0.406: X1.1 C6.2 12.7,12.7 13.97,11.43 R6.2 | IC4.3 IC4.2
  Bottom 0.406: R6.2 16.51,11.43 17.78,12.7 IC4.3
N$3
  Top 0.406: IC2.21 107.95,38.1 109.22,39.37 109.22,43.18 114.3,48.26 IC6.12
N$4
  Top 0.406: IC2.22 110.49,38.1 111.76,39.37 111.76,44.45 114.3,46.99 116.84,46.99 118.11,48.26 118.11,49.53 116.84,50.8 IC6.13
N$5
  Top 0.406: IC2.23 113.03,38.1 114.3,39.37 114.3,43.18 115.57,44.45 116.84,44.45 119.38,46.99 119.38,49.53 IC6.14
N$6
  Top 0.406: IC2.24 115.57,38.1 116.84,39.37 116.84,43.18 120.65,46.99 120.65,50.8 IC6.15
N$7
  Top 0.406: IC2.25 118.11,38.1 119.38,39.37 119.38,44.45 121.92,46.99 121.92,52.07 IC6.16
N$8
  Top 0.406: IC2.26 120.65,38.1 121.92,39.37 121.92,45.72 123.19,46.99 123.19,53.34 IC6.17
N$9
  Top 0.406: IC2.27 123.19,38.1 124.46,39.37 124.46,54.61 IC6.18
N$10
  Top 0.406: IC2.28 125.73,38.1 127,39.37 127,43.18 125.73,44.45 125.73,55.88 IC6.19
N$11
  Top 0.406: IC4.5 IC4.4
N$12  (via drill 0.6)
  Top 0.406: IC4.9 29.21,5.08 27.94,6.35 27.94,17.78 29.21,19.05 v29.21,21.59 | v43.18,26.67 48.26,31.75 48.26,35.56 50.8,38.1 IC5.12
  Bottom 0.406: v29.21,21.59 38.1,21.59 v43.18,26.67
N$13
  Top 0.406: C13.+ 92.71,80.01 88.9,83.82 S2.2
N$14
  Top 0.406: C28.1 144.78,44.45 R15.2
  Bottom 0.406: R12.2 R9.2 152.4,55.88 IC3.9 146.05,49.53 146.05,46.99 R15.2
N$15
  Bottom 0.406: C9.+ 138.68,71.37 138.43,71.12 R7.2
N$16
  Top 0.406: IC2.33 IC2.32 133.35,22.86 116.84,22.86 R2.2
N$17
  Bottom 0.406: VR1.I2 143.51,85.09 152.4,85.09 154.94,82.55 154.69,82.55 C11.-
N$18
  Top 0.406: IC3.2 139.7,60.96 R7.1 R8.2 C26.1
N$19  (via drill 0.6)
  Top 0.406: R23.1 157.48,29.21 152.4,34.29 v152.4,45.72 | IC3.12 152.4,58.42 v152.4,49.53
  Bottom 0.406: v152.4,49.53 v152.4,45.72
N$20
  Top 0.406: R17.2 54.61,64.77 53.34,66.04 IC14.7
N$21
  Bottom 0.406: C12.+ 144.78,67.31 144.78,58.42 143.51,57.15 139.7,57.15 R10.2
N$22
  Top 0.406: J2.T 119.38,80.01 120.65,78.74 128.27,78.74 134.87,72.14 C10.-
N$23
  Top 0.406: C13.- J3.T
N$24
  Top 0.406: 139.7,53.34 138.43,53.34 R11.2 C27.1 | 139.7,53.34 IC3.6 | R10.1 138.43,52.07 139.7,53.34
N$25
  Top 0.406: C26.2 R8.1 138.43,66.04 IC3.1 146.05,62.23 146.05,49.53 147.32,48.26 R9.1
  Bottom 0.406: C10.+ 136.91,70.87 135.89,69.85 R8.1
N$26  (via drill 0.6)
  Top 0.406: S2.1 92.9,88.71 95.25,86.36 116.84,86.36 v123.19,80.01 | C28.2 138.43,45.72 R15.1
  Bottom 0.406: v123.19,80.01 130.81,72.39 130.81,48.26 133.35,45.72 R15.1 139.7,45.72 140.97,44.45 146.05,44.45 147.32,45.72 147.32,48.26 IC3.8
N$27
  Top 0.813: D1.A 24.13,93.79 S1.3
N$28
  Top 0.406: IC3.5 144.78,58.42 144.78,59.69 143.51,60.96 IC3.3 | R14.1 154.94,60.96 | 154.94,60.96 R13.2 | C14.+ 154.94,60.96
  Bottom 0.406: R13.2 153.67,58.42 151.13,55.88 IC3.10 IC3.5
N$29  (via drill 0.6)
  Top 0.406: IC6.1 109.22,68.58 110.49,67.31 110.49,45.72 106.68,41.91 101.6,41.91 v99.06,44.45 | v71.12,44.45 71.12,5.08 69.85,3.81 60.96,3.81 v59.69,5.08 | v54.61,5.08 53.34,3.81 48.26,3.81 v45.72,6.35
  Bottom 0.406: v99.06,44.45 v71.12,44.45 | v59.69,5.08 v54.61,5.08 | v45.72,6.35 43.18,6.35 41.91,7.62 IC4.10
N$30
  Top 0.406: VR1.O1 143.51,87.63 143.51,74.68 C9.-
N$31
  Top 0.813: J1.PWR 15.51,89.17 22.86,96.52 26.67,96.52 27.94,95.25 S1.2
N$32
  Top 0.406: C12.- 146.3,73.41 144.78,74.93 VR1.O2
N$33  (via drill 0.6)
  Top 0.406: v26.67,15.24 26.67,21.59 v27.94,22.86 | v72.39,30.48 72.39,17.78 73.66,16.51 86.36,16.51 87.63,15.24 87.63,11.43 v88.9,10.16
  Bottom 0.406: R19.2 R20.2 | R20.2 128.27,11.43 128.27,7.62 IC13.6 | v27.94,22.86 38.1,22.86 44.45,29.21 48.26,29.21 50.8,31.75 63.5,31.75 64.77,30.48 v72.39,30.48 | v88.9,10.16 97.79,10.16 99.06,8.89 120.65,8.89 R20.2
N$34
  Top 0.406: IC14.2 45.72,67.31 45.72,74.93 50.8,80.01 67.31,80.01 R16.2 D2.C
N$35
  Top 0.813: 15.24,78.74 7.62,78.74 6.35,77.47 IC12.1 | 15.24,78.74 29.21,78.74 C1.+ D1.C | C2.1 15.24,78.74
N$36  (via drill 0.6)
  Top 0.406: 142.24,48.26 143.51,46.99 154.94,46.99 R12.1 | 142.24,48.26 140.97,46.99 137.16,46.99 R11.1 C27.2 | v124.46,80.01 116.84,87.63 97.79,87.63 96.52,88.9 96.52,92.71 92.71,96.52 87.44,96.52 S2.3 | 142.24,48.26 IC3.7
  Bottom 0.406: v124.46,80.01 132.08,72.39 132.08,49.53 133.35,48.26 R11.1
N$37
  Bottom 0.406: Q1.2 116.84,19.05 R19.1
N$38
  Top 0.406: R20.1 115.57,11.43 Q2.2
N$39
  Top 0.406: IC13.2 120.65,7.62 124.46,11.43 125.73,11.43 128.27,13.97 151.55,13.97 BAT1.1 R23.2
N$40  (via drill 0.6)
  Top 0.406: R24.2 45.72,77.47 44.45,76.2 26.67,76.2 25.4,74.93 25.4,66.04 24.13,64.77 21.59,64.77 19.05,62.23 19.05,57.15 16.51,54.61 16.51,21.59 17.78,20.32 v17.78,13.97
  Bottom 0.406: v17.78,13.97 29.21,13.97 IC4.12
N$41
  Top 0.406: R24.1 38.1,83.82 39.37,85.09 X3.4
N$42
  Top 0.406: X3.5 54.61,85.09 55.88,83.82 R25.1
R/W  (via drill 0.6)
  Top 0.406: IC2.34 140.97,35.56 139.7,36.83 133.35,36.83 132.08,38.1 132.08,43.18 128.27,46.99 128.27,57.15 118.11,67.31 118.11,68.58 v113.03,73.66 | IC1.26 31.75,63.5 33.02,64.77 v33.02,73.66 | v25.4,10.16 25.4,19.05 20.32,24.13 20.32,45.72 21.59,46.99 24.13,46.99 25.4,48.26 25.4,49.53 26.67,50.8 v26.67,63.5
  Bottom 0.406: v33.02,73.66 v113.03,73.66 | IC4.11 v25.4,10.16 | IC1.26 v26.67,63.5
RAW1
  Top 0.406: C8.+ 158.75,82.8 158.75,45.72 R3.2 IC2.1
RAW2
  Top 0.406: IC2.2 153.67,43.18 R4.2 157.48,46.99 157.48,76.45 C11.+
RESET  (via drill 0.6)
  Top 0.406: SV1.5 R1.1 13.97,57.15 v13.97,60.96 | C7.2 17.78,62.23 20.32,64.77 20.32,66.04 IC1.1
  Bottom 0.406: v13.97,60.96 C7.2
ROW_EN  (via drill 0.6)
  Top 0.406: IC5.13 v48.26,36.83 | v31.75,36.83 29.21,36.83 26.67,34.29 v26.67,24.13 | v15.24,24.13 13.97,22.86 11.43,22.86 10.16,24.13 10.16,31.75 SV2.8
  Bottom 0.406: v48.26,36.83 v31.75,36.83 | v26.67,24.13 v15.24,24.13
SCK  (via drill 0.6)
  Top 0.406: v33.02,45.72 v33.02,62.23 | v15.24,62.23 15.24,55.88 11.43,52.07 SV1.3
  Bottom 0.406: IC1.19 v33.02,45.72 | v33.02,62.23 v15.24,62.23
SWITCHCOL_EN
  Top 0.406: IC4.8 27.94,2.54 26.67,3.81 21.59,3.81 16.51,8.89 16.51,20.32 15.24,21.59 7.62,21.59 6.35,22.86 6.35,34.29 7.62,35.56 SV2.10
VBAT  (via drill 0.6)
  Top 0.406: IC3.14 IC3.13 147.32,60.96 v147.32,54.61 | IC1.28 30.48,73.66 31.75,74.93 44.45,74.93 v48.26,78.74 | v144.78,54.61 140.97,54.61 139.7,55.88 139.7,57.15 130.81,57.15 120.65,67.31 120.65,68.58 v111.76,77.47
  Bottom 0.406: v48.26,78.74 54.61,78.74 55.88,77.47 v111.76,77.47 | IC3.14 IC3.13 | v147.32,54.61 v144.78,54.61
VCC  (via drill 0.6)
  Top 0.406: R18.2 53.34,68.58 | C24.1 129.54,6.35 IC13.8 | R1.2 12.7,63.5 16.51,63.5 | C3.1 16.51,66.04
  Top 0.61: IC1.7 C15.1 | 55.88,1.27 119.38,1.27 123.19,5.08 123.19,7.62 IC13.8 | 55.88,1.27 33.02,1.27 | 33.02,1.27 10.16,1.27 8.89,2.54 8.89,7.62 7.62,8.89 2.54,8.89 1.27,10.16 1.27,33.02 SV2.14 SV2.16 8.89,46.99 11.43,49.53 | IC5.16 C19.1 57.15,50.8 C25.1 53.34,68.58 IC14.8 | 33.02,1.27 34.29,2.54 34.29,13.97 IC4.14 C18.1 | 11.43,50.8 6.35,50.8 SV1.2 | 55.88,1.27 57.15,2.54 57.15,17.78 55.88,19.05 55.88,22.86 57.15,24.13 C21.1 | C4.+ 16.51,66.04 16.51,63.5 16.51,55.88 11.43,50.8 | C4.+ 19.05,77.47 v35.56,77.47 | 129.54,69.85 123.19,76.2 v119.38,76.2 | R13.1 152.4,69.85 129.54,69.85 | IC3.4 C17.1 135.89,59.69 134.62,59.69 130.81,63.5 130.81,68.58 129.54,69.85 | v102.87,43.18 102.87,62.23 C23.1 | 11.43,50.8 11.43,49.53 | 11.43,49.53 v15.24,49.53 | IC12.3 8.89,71.12 12.7,74.93 C4.+
  Bottom 0.406: R2.1 106.68,22.86
  Bottom 0.61: IC1.20 25.4,48.26 24.13,49.53 C15.1 v15.24,49.53 | C4.+ 16.51,71.12 17.78,69.85 R5.2 50.8,69.85 IC14.8 53.34,68.58 | C25.1 58.42,69.85 66.04,69.85 67.31,68.58 IC8.20 C22.1 80.01,68.58 81.28,69.85 87.63,69.85 88.9,68.58 IC9.20 C23.1 101.6,68.58 102.87,69.85 110.49,69.85 111.76,68.58 IC6.20 C20.1 | IC7.20 C21.1 | v35.56,77.47 53.34,77.47 54.61,76.2 v119.38,76.2 | IC2.40 C16.1 153.67,19.05 134.62,19.05 130.81,22.86 106.68,22.86 105.41,22.86 102.87,25.4 v102.87,43.18
WE  (via drill 0.6)
  Top 0.406: v64.77,33.02 v64.77,62.23
  Bottom 0.406: IC10.29 99.06,34.29 80.01,34.29 78.74,33.02 IC11.29 v64.77,33.02 | v64.77,62.23 R5.1 35.56,64.77 34.29,66.04 IC1.27

### Text on the board
Top: J.F.
tPlace: 6N138 | TL974 | 74'573 | 74'573 | 74'573 | ATmega328 | 74'238 | SRAM 512kx8 | SRAM 512kx8 | 74'573 | 74'04
tNames: DC IN | ON/OFF | MIX/OUT2 | TRI/NOISE/DMC | SQ1/SQ2 | VOLUME | MIDI OUT | MIDI IN | synthesizer board v0.95 | GND | RES | MOSI | SCK | 5V | MISO | 5V | D0 | 5V | D1 | LEN | D2 | REN | D3 | SEN | D4 | AIN | D5 | FRONT PANEL CONNECTOR | GND | D6 | GND | D7 | 3V | CR2032